# Altium schematic sheet 1-MCU.SchDoc
size A1
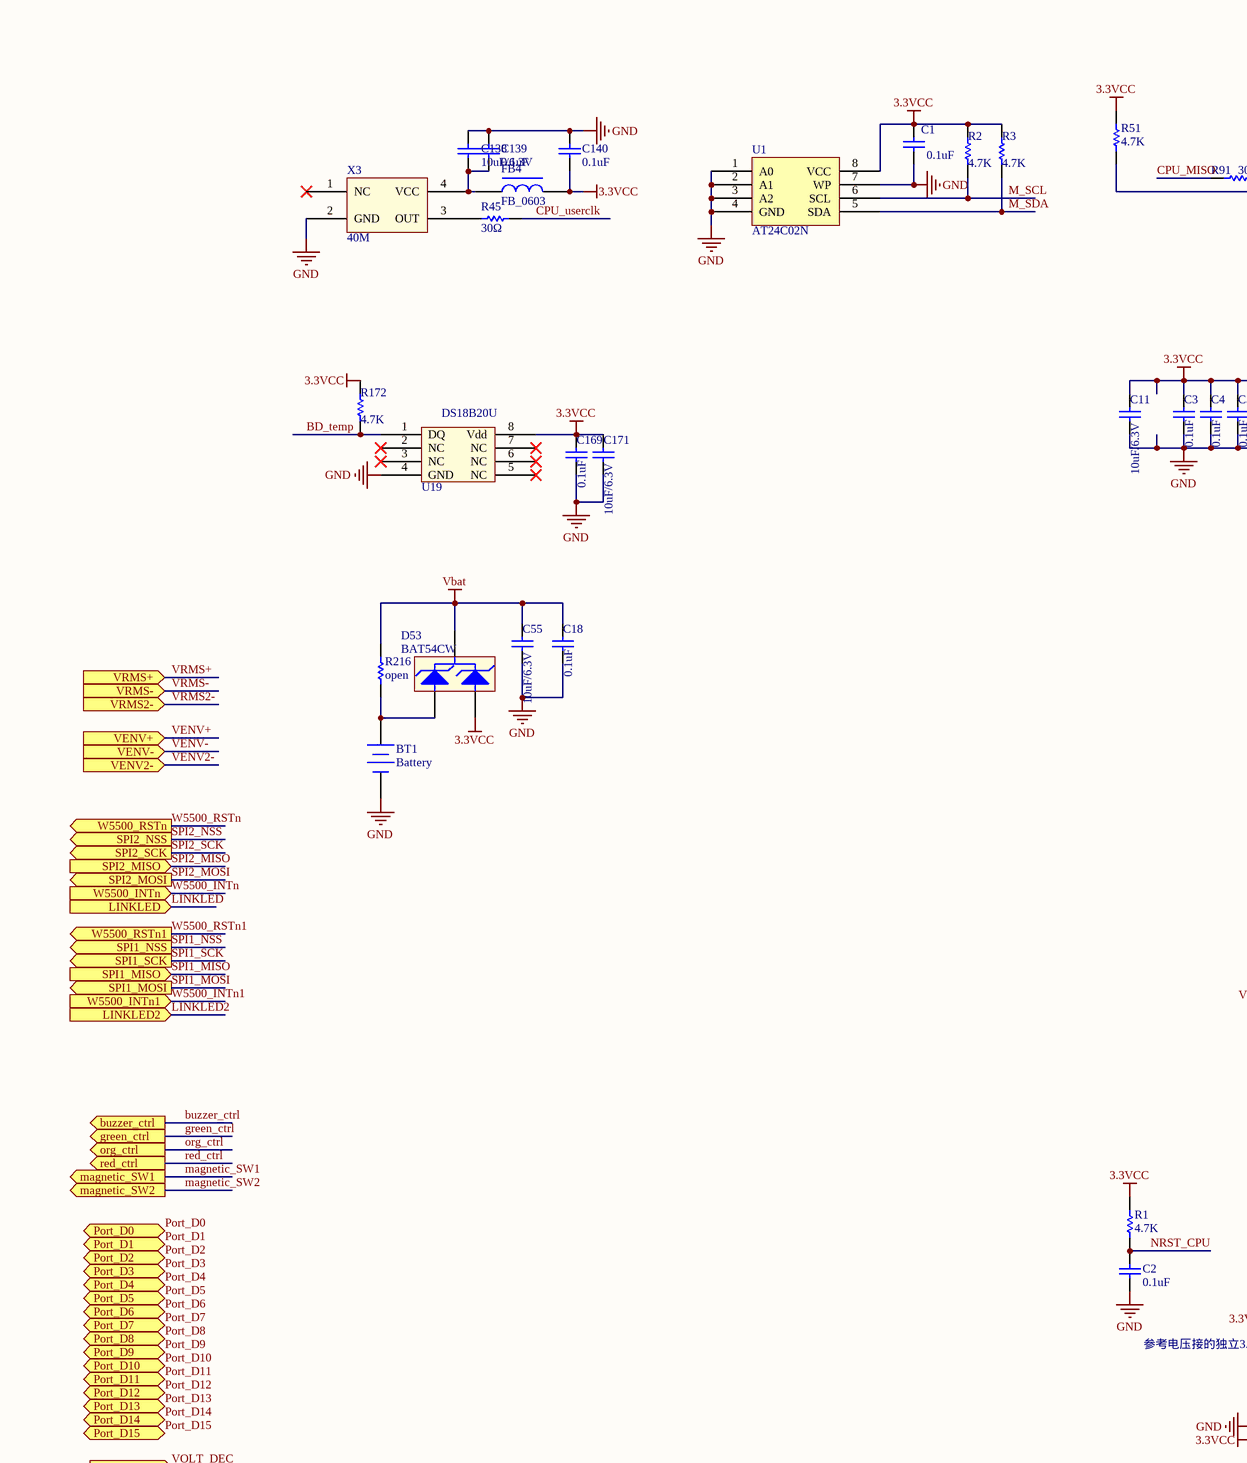
[diagram p0: 1-MCU.SchDoc, top left]
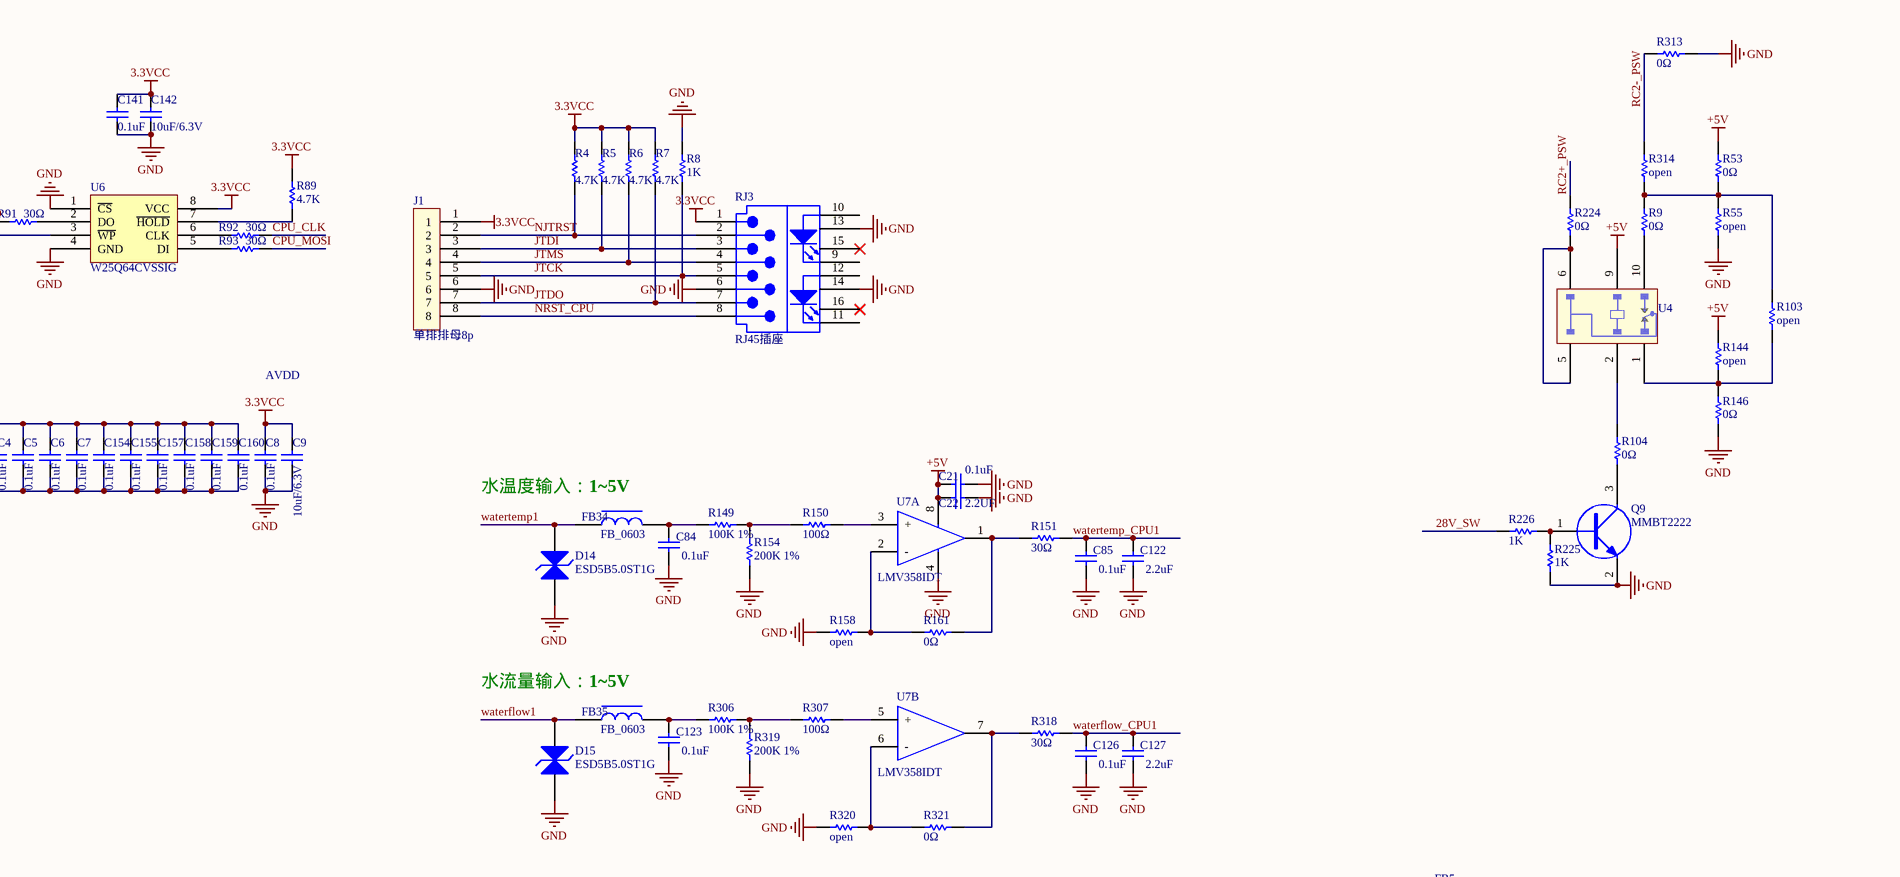
[diagram p1: 1-MCU.SchDoc, top middle]
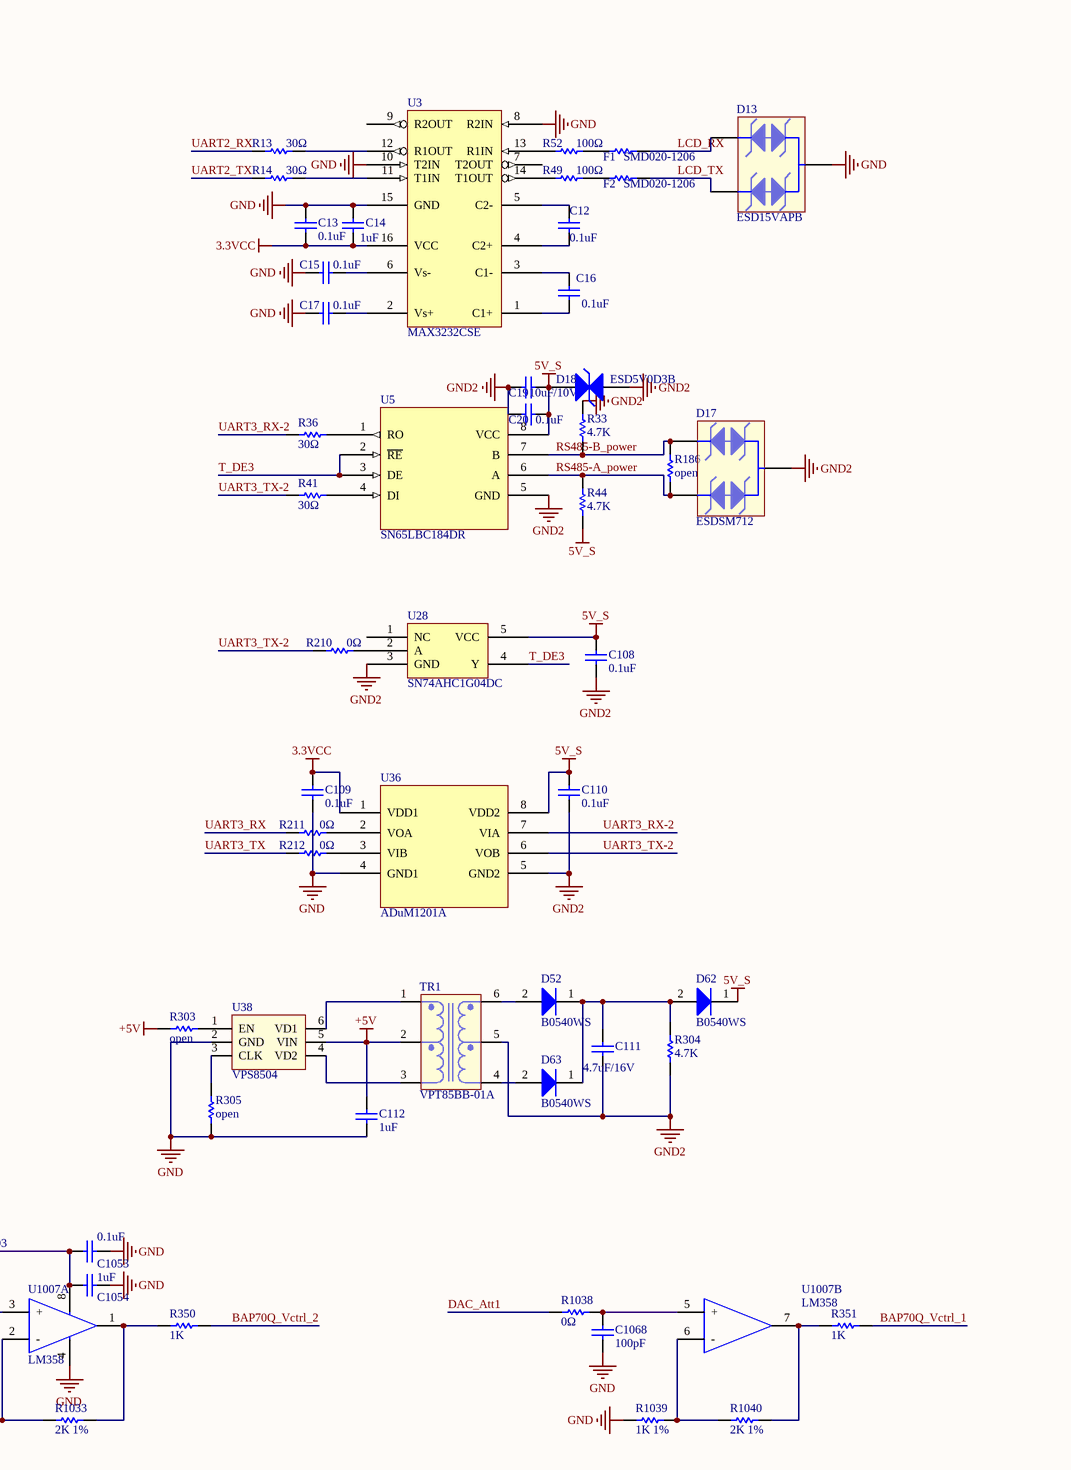
[diagram p2: 1-MCU.SchDoc, top right]
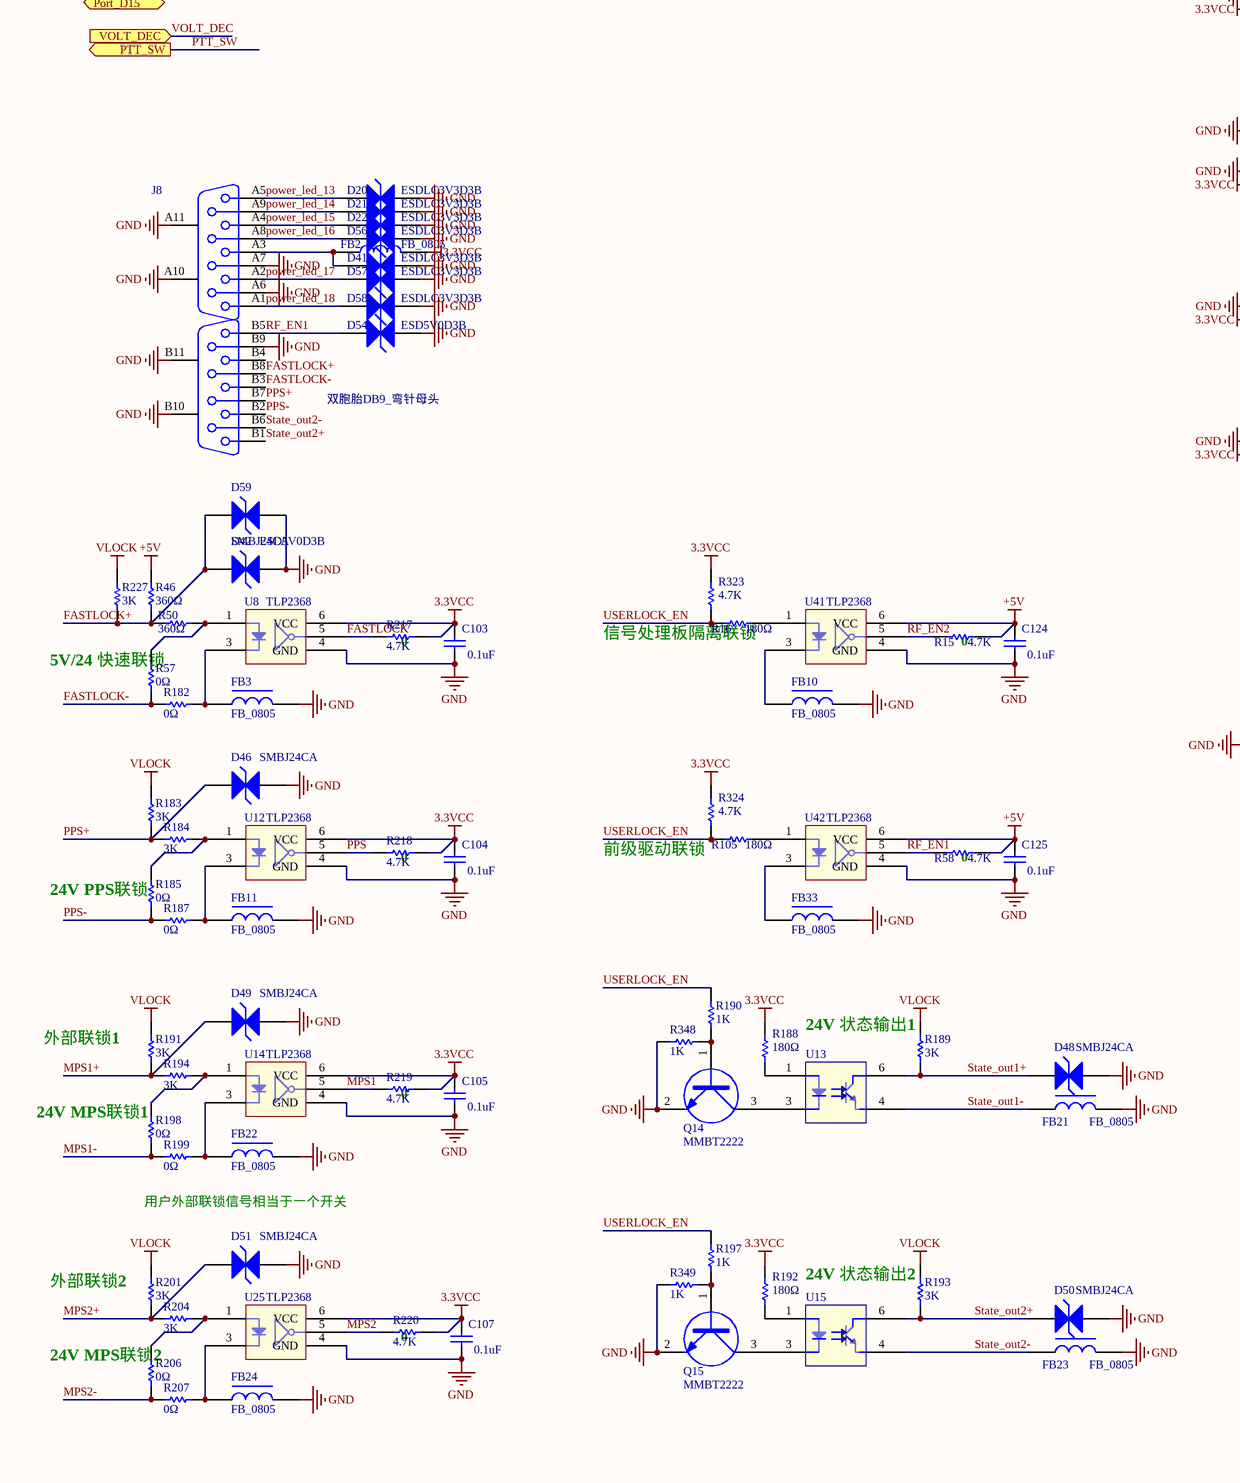
[diagram p3: 1-MCU.SchDoc, bottom left]
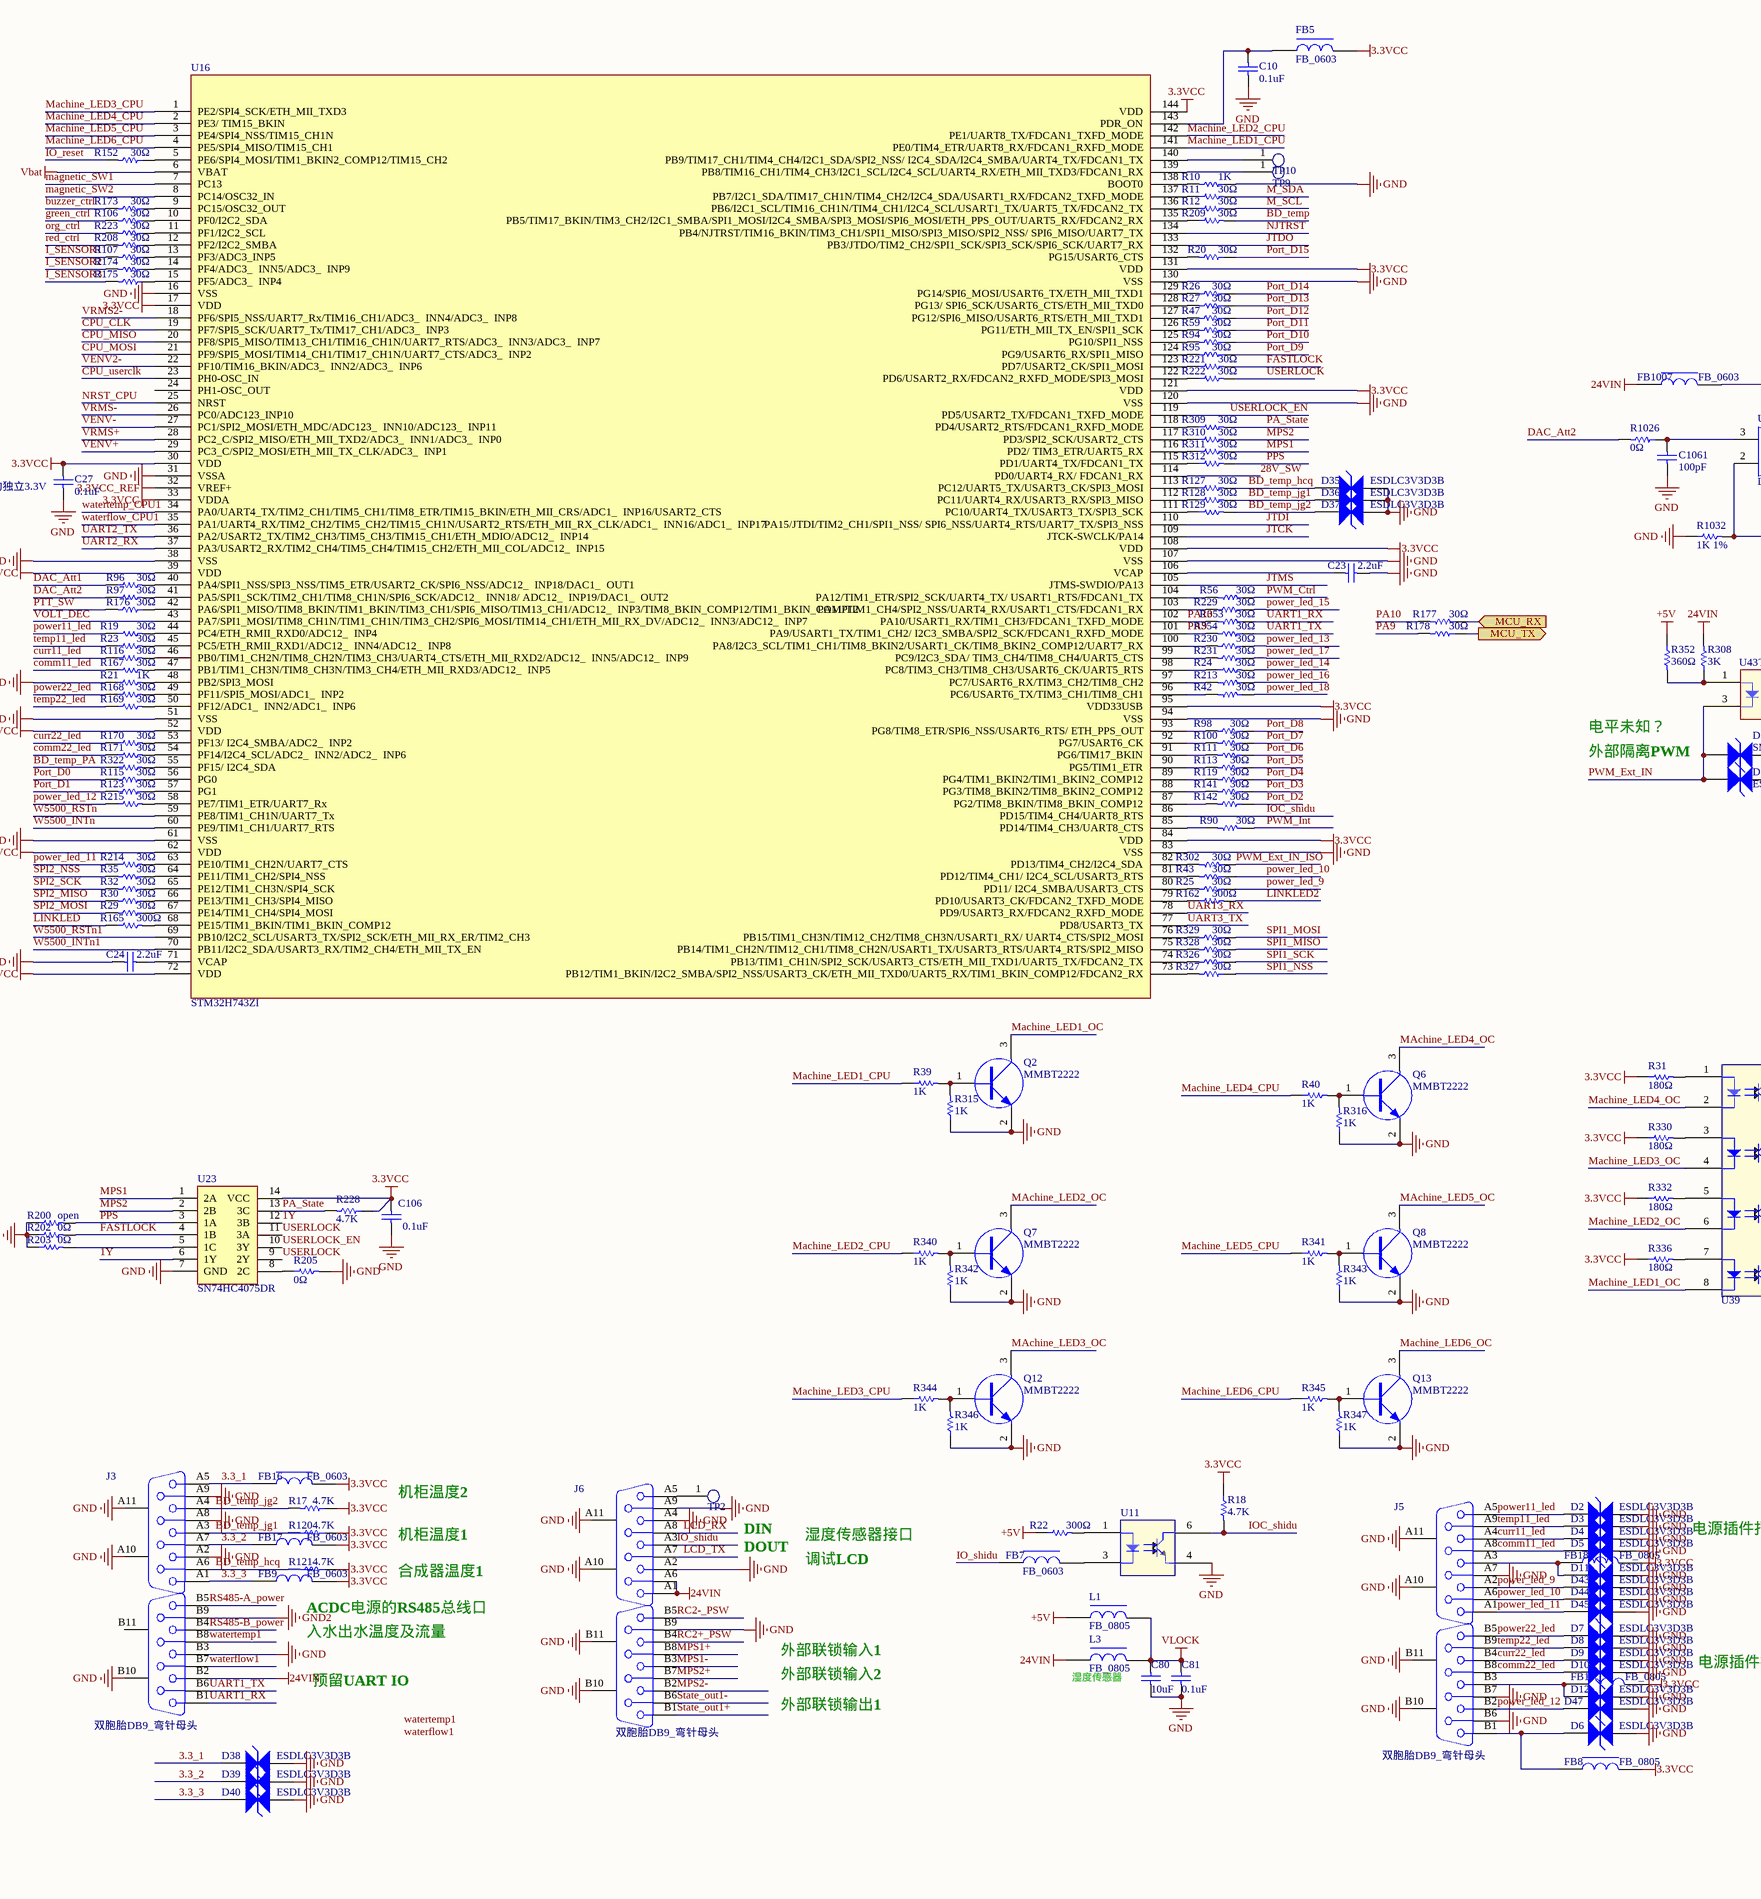
[diagram p4: 1-MCU.SchDoc, bottom middle]
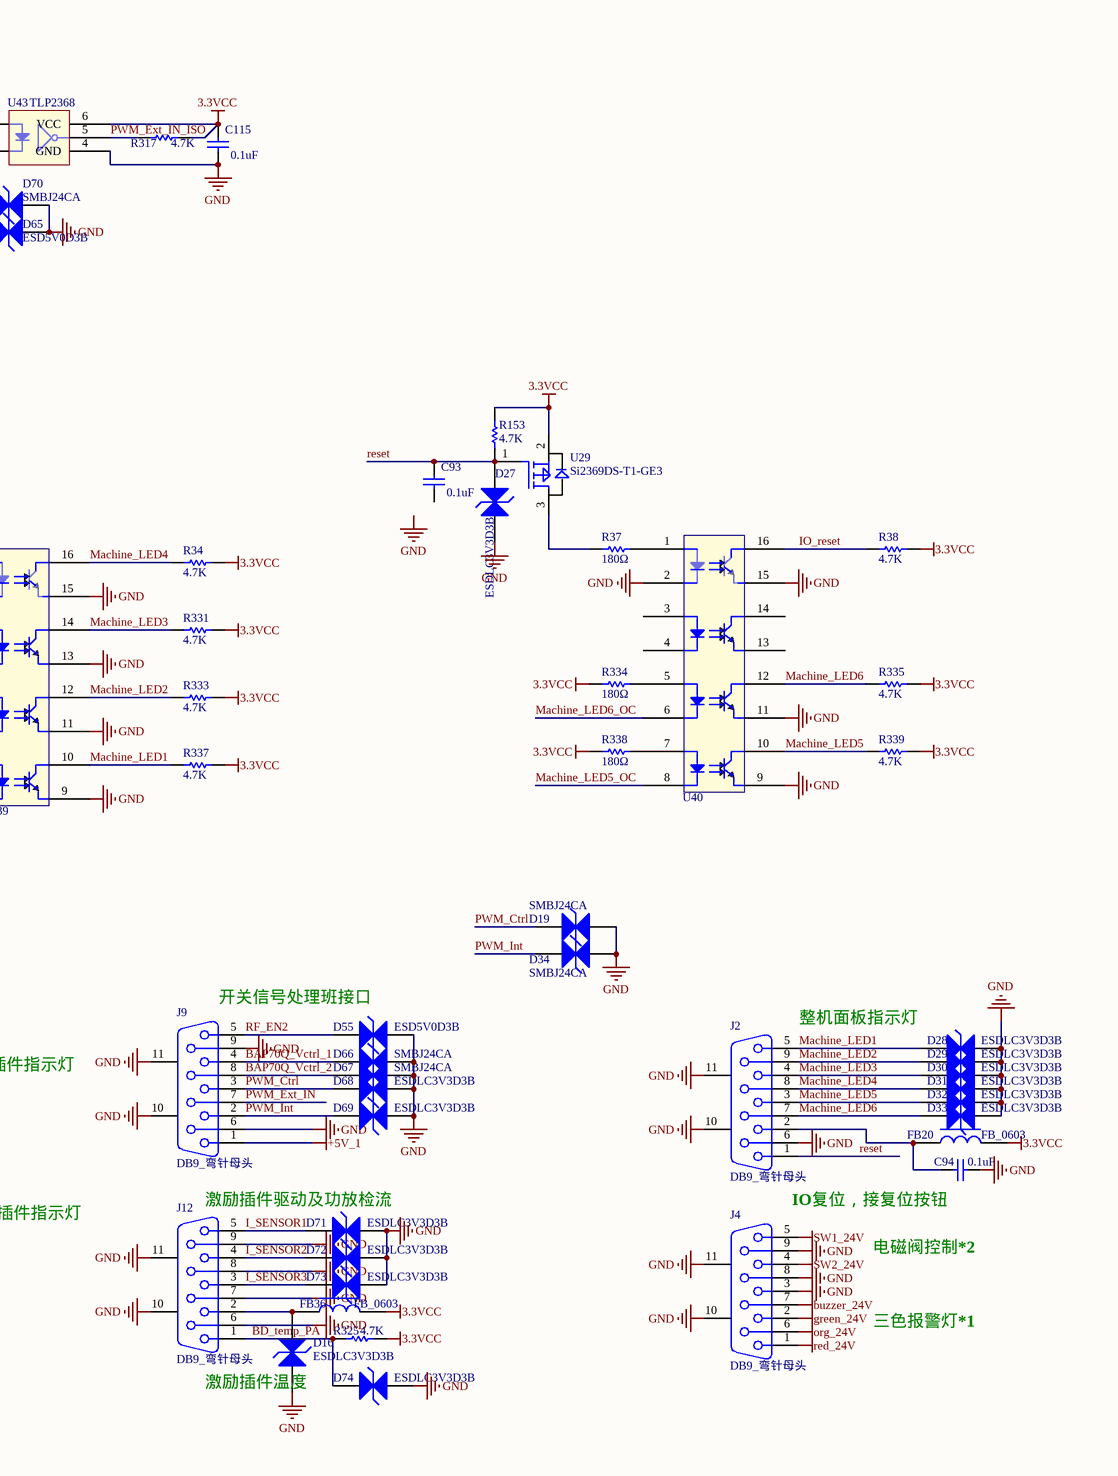
[diagram p5: 1-MCU.SchDoc, bottom right]

## Parts
BT1  Battery  [CR2032]
C1  0.1uF  [C0603]
C2  0.1uF  [C0603]
C3  0.1uF  [C0603]
C4  0.1uF  [C0603]
C5  0.1uF  [C0603]
C6  0.1uF  [C0603]
C7  0.1uF  [C0603]
C8  0.1uF  [C0603]
C9  10uF/6.3V  [C0603]
C10  0.1uF  [C0603]
C11  10uF/6.3V  [C0603]
C12  0.1uF  [C0603]
C13  0.1uF  [C0603]
C14  1uF  [C0603]
C15  0.1uF  [C0603]
C16  0.1uF  [C0603]
C17  0.1uF  [C0603]
C18  0.1uF  [C0603]
C19  10uF/10V  [C0805]
C20  0.1uF  [C0603]
C21  0.1uF  [C0603]
C22  2.2UF  [C0603]
C23  2.2uF  [C0603]
C24  2.2uF  [C0603]
C27  0.1uF  [C0603]
C55  10uF/6.3V  [C0603]
C80  10uF  [C1210]
C81  0.1uF  [C0603]
C84  0.1uF  [C0603]
C85  0.1uF  [C0603]
C93  0.1uF  [C0603]
C94  0.1uF  [C0603]
C103  0.1uF  [C0603]
C104  0.1uF  [C0603]
C105  0.1uF  [C0603]
C106  0.1uF  [C0603]
C107  0.1uF  [C0603]
C108  0.1uF  [C0603]
C109  0.1uF  [C0603]
C110  0.1uF  [C0603]
C111  4.7uF/16V  [C0603]
C112  1uF  [C0603]
C115  0.1uF  [C0603]
C122  2.2uF  [C0603]
C123  0.1uF  [C0603]
C124  0.1uF  [C0603]
C125  0.1uF  [C0603]
C126  0.1uF  [C0603]
C127  2.2uF  [C0603]
C138  10uF/6.3V  [C0603]
C139  0.1uF  [C0603]
C140  0.1uF  [C0603]
C141  0.1uF  [C0603]
C142  10uF/6.3V  [C0603]
C154  0.1uF  [C0603]
C155  0.1uF  [C0603]
C157  0.1uF  [C0603]
C158  0.1uF  [C0603]
C159  0.1uF  [C0603]
C160  0.1uF  [C0603]
C169  0.1uF  [C0603]
C171  10uF/6.3V  [C0603]
C1053  0.1uF  [C0603]
C1054  1uF  [C0603]
C1061  100pF  [C0603]
C1068  100pF  [C0603]
D2  ESDLC3V3D3B  [SOD-323]
D3  ESDLC3V3D3B  [SOD-323]
D4  ESDLC3V3D3B  [SOD-323]
D5  ESDLC3V3D3B  [SOD-323]
D6  ESDLC3V3D3B  [SOD-323]
D7  ESDLC3V3D3B  [SOD-323]
D8  ESDLC3V3D3B  [SOD-323]
D9  ESDLC3V3D3B  [SOD-323]
D10  ESDLC3V3D3B  [SOD-323]
D11  ESDLC3V3D3B  [SOD-323]
D12  ESDLC3V3D3B  [SOD-323]
D13  ESD15VAPB  [SOT23-3]
D14  ESD5B5.0ST1G  [SOD-523]
D15  ESD5B5.0ST1G  [SOD-523]
D16  ESDLC3V3D3B  [SOD-323]
D17  ESDSM712  [SOT23-3]
D18  ESD5V0D3B  [SOD-323]
D19  SMBJ24CA  [DO-214AA]  (no BOM)
D20  ESDLC3V3D3B  [SOD-323]
D21  ESDLC3V3D3B  [SOD-323]
D22  ESDLC3V3D3B  [SOD-323]
D27  ESDLC3V3D3B  [SOD-323]
D28  ESDLC3V3D3B  [SOD-323]
D29  ESDLC3V3D3B  [SOD-323]
D30  ESDLC3V3D3B  [SOD-323]
D31  ESDLC3V3D3B  [SOD-323]
D32  ESDLC3V3D3B  [SOD-323]
D33  ESDLC3V3D3B  [SOD-323]
D34  SMBJ24CA  [DO-214AA]  (no BOM)
D35  ESDLC3V3D3B  [SOD-323]
D36  ESDLC3V3D3B  [SOD-323]
D37  ESDLC3V3D3B  [SOD-323]
D38  ESDLC3V3D3B  [SOD-323]
D39  ESDLC3V3D3B  [SOD-323]
D40  ESDLC3V3D3B  [SOD-323]
D41  ESDLC3V3D3B  [SOD-323]
D42  ESD5V0D3B  [SOD-323]
D43  ESDLC3V3D3B  [SOD-323]
D44  ESDLC3V3D3B  [SOD-323]
D45  ESDLC3V3D3B  [SOD-323]
D46  SMBJ24CA  [DO-214AA]
D47  ESDLC3V3D3B  [SOD-323]
D48  SMBJ24CA  [DO-214AA]
D49  SMBJ24CA  [DO-214AA]
D50  SMBJ24CA  [DO-214AA]
D51  SMBJ24CA  [DO-214AA]
D52  B0540WS  [SOD-323]
D53  BAT54CW  [SOT-323]
D54  ESD5V0D3B  [SOD-323]
D55  ESD5V0D3B  [SOD-323]
D56  ESDLC3V3D3B  [SOD-323]
D57  ESDLC3V3D3B  [SOD-323]
D58  ESDLC3V3D3B  [SOD-323]
D59  SMBJ24CA  [DO-214AA]  (no BOM)
D62  B0540WS  [SOD-323]
D63  B0540WS  [SOD-323]
D65  ESD5V0D3B  [SOD-323]
D66  SMBJ24CA  [DO-214AA]
D67  SMBJ24CA  [DO-214AA]
D68  ESDLC3V3D3B  [SOD-323]
D69  ESDLC3V3D3B  [SOD-323]
D70  SMBJ24CA  [DO-214AA]  (no BOM)
D71  ESDLC3V3D3B  [SOD-323]
D72  ESDLC3V3D3B  [SOD-323]
D73  ESDLC3V3D3B  [SOD-323]
D74  ESDLC3V3D3B  [SOD-323]
F1  SMD020-1206  [R1206]
F2  SMD020-1206  [R1206]
FB2  FB_0805  [L0805]
FB3  FB_0805  [L0805]
FB4  FB_0603  [L0603]
FB5  FB_0603  [L0603]
FB7  FB_0603  [L0603]
FB8  FB_0805  [L0805]
FB9  FB_0603  [L0603]
FB10  FB_0805  [L0805]
FB11  FB_0805  [L0805]
FB16  FB_0603  [L0603]
FB17  FB_0603  [L0603]
FB18  FB_0805  [L0805]
FB19  FB_0805  [L0805]
FB20  FB_0603  [L0603]
FB21  FB_0805  [L0805]
FB22  FB_0805  [L0805]
FB23  FB_0805  [L0805]
FB24  FB_0805  [L0805]
FB33  FB_0805  [L0805]
FB34  FB_0603  [L0603]
FB35  FB_0603  [L0603]
FB36  FB_0603  [L0603]
FB1007  FB_0603  [L0603]
J1  单排排母8p  [SIP8TM-2R54]
J2  DB9_弯针母头  [DB9TM-RF]
J3  双胞胎DB9_弯针母头  [DB9TM-RF-双胞胎]
J4  DB9_弯针母头  [DB9TM-RF]
J5  双胞胎DB9_弯针母头  [DB9TM-RF-双胞胎]
J6  双胞胎DB9_弯针母头  [DB9TM-RF-双胞胎]
J8  双胞胎DB9_弯针母头  [DB9TM-RF-双胞胎]
J9  DB9_弯针母头  [DB9TM-RF]
J12  DB9_弯针母头  [DB9TM-RF]
L1  FB_0805  [L0805]
L3  FB_0805  [L0805]  (no BOM)
Q2  MMBT2222  [SOT23-3]
Q6  MMBT2222  [SOT23-3]
Q7  MMBT2222  [SOT23-3]
Q8  MMBT2222  [SOT23-3]
Q9  MMBT2222  [SOT23-3]
Q12  MMBT2222  [SOT23-3]
Q13  MMBT2222  [SOT23-3]
Q14  MMBT2222  [SOT23-3]
Q15  MMBT2222  [SOT23-3]
R1  4.7K  [R0603]
R2  4.7K  [R0603]
R3  4.7K  [R0603]
R4  4.7K  [R0603]
R5  4.7K  [R0603]
R6  4.7K  [R0603]
R7  4.7K  [R0603]
R8  1K  [R0603]
R9  0Ω  [R0603]
R10  1K  [R0603]
R11  30Ω  [R0603]
R12  30Ω  [R0603]
R13  30Ω  [R0603]
R14  30Ω  [R0603]
R15  4.7K  [R0603]
R16  180Ω  [R0603]
R17  4.7K  [R0603]
R18  4.7K  [R0603]
R19  30Ω  [R0603]
R20  30Ω  [R0603]
R21  1K  [R0603]
R22  300Ω  [R0603]
R23  30Ω  [R0603]
R24  30Ω  [R0603]
R25  30Ω  [R0603]
R26  30Ω  [R0603]
R27  30Ω  [R0603]
R29  30Ω  [R0603]
R30  30Ω  [R0603]
R31  180Ω  [R0603]
R32  30Ω  [R0603]
R33  4.7K  [R0603]
R34  4.7K  [R0603]
R35  30Ω  [R0603]
R36  30Ω  [R0603]
R37  180Ω  [R0603]
R38  4.7K  [R0603]
R39  1K  [R0603]
R40  1K  [R0603]
R41  30Ω  [R0603]
R42  30Ω  [R0603]
R43  30Ω  [R0603]
R44  4.7K  [R0603]
R45  30Ω  [R0603]
R46  360Ω  [R0603]
R47  30Ω  [R0603]
R49  100Ω  [R0603]
R50  360Ω  [R1206]  (no BOM)
R51  4.7K  [R0603]
R52  100Ω  [R0603]
R53  0Ω  [R0603]
R55  open  [R0603]  (no BOM)
R56  30Ω  [R0603]
R57  0Ω  [R0603]
R58  4.7K  [R0603]
R59  30Ω  [R0603]
R89  4.7K  [R0603]
R90  30Ω  [R0603]
R91  30Ω  [R0603]
R92  30Ω  [R0603]
R93  30Ω  [R0603]
R94  30Ω  [R0603]
R95  30Ω  [R0603]
R96  30Ω  [R0603]
R97  30Ω  [R0603]
R98  30Ω  [R0603]
R100  30Ω  [R0603]
R103  open  [R0603]  (no BOM)
R104  0Ω  [R0603]
R105  180Ω  [R0603]
R106  30Ω  [R0603]
R107  30Ω  [R0603]
R111  30Ω  [R0603]
R113  30Ω  [R0603]
R115  30Ω  [R0603]
R116  30Ω  [R0603]
R119  30Ω  [R0603]
R120  4.7K  [R0603]
R121  4.7K  [R0603]
R123  30Ω  [R0603]
R127  30Ω  [R0603]
R128  30Ω  [R0603]
R129  30Ω  [R0603]
R141  30Ω  [R0603]
R142  30Ω  [R0603]
R144  open  [R0603]  (no BOM)
R146  0Ω  [R0603]
R149  100K 1%  [R0603]
R150  100Ω  [R0603]
R151  30Ω  [R0603]
R152  30Ω  [R0603]
R153  4.7K  [R0603]
R154  200K 1%  [R0603]
R158  open  [R0603]  (no BOM)
R161  0Ω  [R0603]
R162  300Ω  [R0603]
R165  300Ω  [R0603]
R167  30Ω  [R0603]
R168  30Ω  [R0603]
R169  30Ω  [R0603]
R170  30Ω  [R0603]
R171  30Ω  [R0603]
R172  4.7K  [R0603]
R173  30Ω  [R0603]
R174  30Ω  [R0603]
R175  30Ω  [R0603]
R176  30Ω  [R0603]
R177  30Ω  [R0603]
R178  30Ω  [R0603]
R182  0Ω  [R0603]  (no BOM)
R183  3K  [R1206]
R184  3K  [R1206]  (no BOM)
R185  0Ω  [R0603]
R186  open  [R0603]  (no BOM)
R187  0Ω  [R0603]  (no BOM)
R188  180Ω  [R0603]
R189  3K  [R1206]
R190  1K  [R0603]
R191  3K  [R1206]
R192  180Ω  [R0603]
R193  3K  [R1206]
R194  3K  [R1206]  (no BOM)
R197  1K  [R0603]
R198  0Ω  [R0603]
R199  0Ω  [R0603]  (no BOM)
R200  open  [R0603]  (no BOM)
R201  3K  [R1206]
R202  0Ω  [R0603]
R203  0Ω  [R0603]
R204  3K  [R1206]  (no BOM)
R205  0Ω  [R0603]
R206  0Ω  [R0603]
R207  0Ω  [R0603]  (no BOM)
R208  30Ω  [R0603]
R209  30Ω  [R0603]
R210  0Ω  [R0603]
R211  0Ω  [R0603]
R212  0Ω  [R0603]
R213  30Ω  [R0603]
R214  30Ω  [R0603]
R215  30Ω  [R0603]
R216  open  [R0603]  (no BOM)
R217  4.7K  [R0603]
R218  4.7K  [R0603]
R219  4.7K  [R0603]
R220  4.7K  [R0603]
R221  30Ω  [R0603]
R222  30Ω  [R0603]
R223  30Ω  [R0603]
R224  0Ω  [R0603]
R225  1K  [R0603]
R226  1K  [R0603]
R227  3K  [R1206]  (no BOM)
R228  4.7K  [R0603]
R229  30Ω  [R0603]
R230  30Ω  [R0603]
R231  30Ω  [R0603]
R302  30Ω  [R0603]
R303  open  [R0603]  (no BOM)
R304  4.7K  [R0603]
R305  open  [R0603]  (no BOM)
R306  100K 1%  [R0603]
R307  100Ω  [R0603]
R308  3K  [R1206]  (no BOM)
R309  30Ω  [R0603]
R310  30Ω  [R0603]
R311  30Ω  [R0603]
R312  30Ω  [R0603]
R313  0Ω  [R0603]
R314  open  [R0603]  (no BOM)
R315  1K  [R0603]
R316  1K  [R0603]
R317  4.7K  [R0603]
R318  30Ω  [R0603]
R319  200K 1%  [R0603]
R320  open  [R0603]  (no BOM)
R321  0Ω  [R0603]
R322  30Ω  [R0603]
R323  4.7K  [R0603]
R324  4.7K  [R0603]
R325  4.7K  [R0603]
R326  30Ω  [R0603]
R327  30Ω  [R0603]
R328  30Ω  [R0603]
R329  30Ω  [R0603]
R330  180Ω  [R0603]
R331  4.7K  [R0603]
R332  180Ω  [R0603]
R333  4.7K  [R0603]
R334  180Ω  [R0603]
R335  4.7K  [R0603]
R336  180Ω  [R0603]
R337  4.7K  [R0603]
R338  180Ω  [R0603]
R339  4.7K  [R0603]
R340  1K  [R0603]
R341  1K  [R0603]
R342  1K  [R0603]
R343  1K  [R0603]
R344  1K  [R0603]
R345  1K  [R0603]
R346  1K  [R0603]
R347  1K  [R0603]
R348  1K  [R0603]
R349  1K  [R0603]
R350  1K  [R0603]
R351  1K  [R0603]
R352  360Ω  [R0603]
R353  30Ω  [R0603]  (no BOM)
R354  30Ω  [R0603]  (no BOM)
R1026  0Ω  [R0603]
R1032  1K 1%  [R0603]
R1033  2K 1%  [R0603]
R1038  0Ω  [R0603]
R1039  1K 1%  [R0603]
R1040  2K 1%  [R0603]
RJ3  RJ45插座  [RJ45TH-1x1-2R54-LED]
TP2  TEST  [TP0R8]  (value not drawn)  (no BOM)
TP9  TEST  [TP0R8]  (value not drawn)  (no BOM)
TP10  TEST  [TP0R8]  (value not drawn)  (no BOM)
TR1  VPT85BB-01A  [VPT85BB-01A-6SM-2R54-6R65X7R45]
U1  AT24C02N  [SOIC8_1R27_3R9x4R9]
U3  MAX3232CSE  [SOIC16-1R27-3R9x9R9]
U4  G5V-1-5VDC  [G5V-1-5VDC]  (value not drawn)
U5  SN65LBC184DR  [SOIC8_1R27_3R9x4R9]
U6  W25Q64CVSSIG  [SOIC8_1R27_5R3x5R3]
U7  LMV358IDT  [SOIC8_1R27_3R9x4R9]  (parts A,B of 2)
U8  TLP2368  [SO6-1R27-4R55X3R7]
U11  TLP181  [TLP181]  (value not drawn)
U12  TLP2368  [SO6-1R27-4R55X3R7]
U13  TLP181  [TLP181]  (value not drawn)
U14  TLP2368  [SO6-1R27-4R55X3R7]
U15  TLP181  [TLP181]  (value not drawn)
U16  STM32H743ZI  [LQFP144_0R5_20x20]
U19  DS18B20U  [TSSOP8-0R65-3R0x3R0]
U23  SN74HC4075DR  [SOIC14-1R27-3R9x8R65]
U25  TLP2368  [SO6-1R27-4R55X3R7]
U28  SN74AHC1G04DC  [SC70-5-1R3x2R2]
U29  Si2369DS-T1-GE3  [SOT23-3]
U36  ADuM1201A  [SOIC8_1R27_3R9x4R9]
U38  VPS8504  [SOT23-6]
U39  LTV-247  [SOIC16-1R27-3R9x9R9]  (value not drawn)
U40  LTV-247  [SOIC16-1R27-3R9x9R9]  (value not drawn)
U41  TLP2368  [SO6-1R27-4R55X3R7]
U42  TLP2368  [SO6-1R27-4R55X3R7]
U43  TLP2368  [SO6-1R27-4R55X3R7]
U1007  LM358  [SOIC8_1R27_3R9x4R9]  (parts A,B of 2)
X3  40M  [CRY4SM-5R0x7R0]

## Ports
buzzer_ctrl (out), green_ctrl (out), LINKLED2 (in), LINKLED (in), magnetic_SW1 (out), magnetic_SW2 (out), MCU_RX (in), MCU_TX (out), org_ctrl (out), Port_D0 (bidir), Port_D1 (bidir), Port_D2 (bidir), Port_D3 (bidir), Port_D4 (bidir), Port_D5 (bidir), Port_D6 (bidir), Port_D7 (bidir), Port_D8 (bidir), Port_D9 (bidir), Port_D10 (bidir), Port_D11 (bidir), Port_D12 (bidir), Port_D13 (bidir), Port_D14 (bidir), Port_D15 (bidir), PTT_SW (out), red_ctrl (out), SPI1_MISO (in), SPI1_MOSI (out), SPI1_NSS (out), SPI1_SCK (out), SPI2_MISO (in), SPI2_MOSI (out), SPI2_NSS (out), SPI2_SCK (out), VENV2- (in), VENV+ (in), VENV- (in), VOLT_DEC (in), VRMS2- (in), VRMS+ (in), VRMS- (in), W5500_INTn1 (in), W5500_INTn (in), W5500_RSTn1 (out), W5500_RSTn (out)

## Nets
3.3VCC: C1.2 C3.2 C4.2 C5.2 C6.2 C7.2 C8.2 C9.2 C11.2 C13.2 C14.1 C27.2 C103.2 C104.2 C105.2 C106.2 C107.2 C109.2 C115.2 C140.1 C141.2 C142.2 C154.2 C155.2 C157.2 C158.2 C159.2 C160.2 C169.2 C171.2 D53.2 FB2.2 FB4.2 FB5.2 FB8.2 FB9.2 FB16.2 FB17.2 FB18.2 FB19.2 FB20.2 FB36.2 J1.1 R1.2 R2.2 R3.2 R4.2 R5.2 R6.2 R7.2 R17.1 R18.1 R31.1 R34.1 R38.1 R51.1 R89.1 R120.1 R121.1 R153.2 R172.2 R188.1 R192.1 R217.1 R218.1 R219.1 R220.1 R228.1 R317.1 R323.1 R324.1 R325.1 R330.1 R331.1 R332.1 R333.1 R334.1 R335.1 R336.1 R337.1 R338.1 R339.1 RJ3.1(TX+) U1.8(VCC) U3.16(VCC) U6.8(VCC) U8.6(VCC) U12.6(VCC) U14.6(VCC) U16.17(VDD) U16.30(VDD) U16.33(VDDA) U16.39(VDD) U16.52(VDD) U16.62(VDD) U16.72(VDD) U16.84(VDD) U16.95(VDD33USB) U16.108(VDD) U16.121(VDD) U16.131(VDD) U16.144(VDD) U19.8(Vdd) U23.14(VCC) U25.6(VCC) U29.2(S) U36.1(VDD1) U43.6(VCC)
3.3VCC_REF: U16.32(VREF+)
5V_S: C19.2 C20.2 C108.2 C110.2 D18.1 D62.1(K) R44.1 U5.8(VCC) U28.5(VCC) U36.8(VDD2)
24VIN: FB1007.1 J3.B2 J6.A1 J6.A6 L3.1 R308.2
+5V: C21.2 C22.1 C112.2 C124.2 C125.2 L1.1 R15.1 R22.1 R46.2 R53.2 R58.1 R144.2 R303.1 R352.1 TR1.2 U4.9 U7.8 U38.5(VIN) U41.6(VCC) U42.6(VCC)
+5V_1: J9.1
buzzer_24V: J4.7
GND: BT1.2(-) C1.1 C2.1 C3.1 C4.1 C5.1 C6.1 C7.1 C8.1 C9.1 C10.2 C11.1 C13.1 C14.2 C15.2 C17.2 C18.1 C21.1 C22.2 C23.1 C24.2 C27.1 C55.1 C80.1 C81.1 C84.1 C85.1 C94.2 C103.1 C104.1 C105.1 C106.1 C107.1 C109.1 C112.1 C115.1 C122.1 C123.1 C124.1 C125.1 C126.1 C127.1 C138.1 C139.2 C140.2 C141.1 C142.1 C154.1 C155.1 C157.1 C158.1 C159.1 C160.1 C169.1 C171.1 C1053.1 C1054.2 C1061.1 C1068.1 D2.2 D3.2 D4.2 D5.2 D6.2 D7.2 D8.2 D9.2 D10.2 D11.2 D12.2 D13.3 D14.1 D15.1 D16.2 D19.1 D20.2 D21.2 D22.2 D27.2 D28.2 D29.2 D30.2 D31.2 D32.2 D33.2 D34.1 D35.2 D36.2 D37.2 D38.2 D39.2 D40.2 D41.2 D42.2 D43.2 D44.2 D45.2 D46.1 D47.2 D48.1 D49.1 D50.1 D51.1 D54.2 D55.2 D56.2 D57.2 D58.2 D59.1 D65.2 D66.1 D67.1 D68.2 D69.2 D70.1 D71.2 D72.2 D73.2 D74.2 FB3.2 FB10.2 FB11.2 FB21.2 FB22.2 FB23.2 FB24.2 FB33.2 J1.6 J2.6 J2.10 J2.11 J3.A2 J3.A8 J3.A9 J3.A10 J3.A11 J3.B3 J3.B10 J4.3 J4.8 J4.9 J4.10 J4.11 J5.A7 J5.A10 J5.A11 J5.B6 J5.B7 J5.B10 J5.B11 J6.A2 J6.A4 J6.A9 J6.A10 J6.A11 J6.B9 J6.B10 J6.B11 J8.A6 J8.A7 J8.A10 J8.A11 J8.B9 J8.B10 J8.B11 J9.6 J9.9 J9.10 J9.11 J12.6 J12.7 J12.8 J12.9 J12.10 J12.11 Q2.2(E) Q6.2(E) Q7.2(E) Q8.2(E) Q9.2(E) Q12.2(E) Q13.2(E) Q14.2(E) Q15.2(E) R8.1 R10.1 R21.1 R55.1 R146.1 R154.1 R158.1 R200.1 R202.1 R203.1 R205.2 R225.1 R305.1 R313.2 R315.1 R316.1 R319.1 R320.1 R342.1 R343.1 R346.1 R347.1 R348.1 R349.1 R1032.1 R1039.1 RJ3.6(RX-) RJ3.13 RJ3.14 U1.1(A0) U1.2(A1) U1.3(A2) U1.4(GND) U1.7(WP) U3.8(R2IN) U3.10(T2IN) U3.15(GND) U6.1(~{CS}) U6.4(GND) U7.4 U8.4(GND) U11.4 U12.4(GND) U14.4(GND) U16.16(VSS) U16.31(VSSA) U16.38(VSS) U16.51(VSS) U16.61(VSS) U16.83(VSS) U16.94(VSS) U16.107(VSS) U16.120(VSS) U16.130(VSS) U19.4(GND) U23.7(GND) U25.4(GND) U36.4(GND1) U38.2(GND) U39.9 U39.11 U39.13 U39.15 U40.2 U40.9 U40.11 U40.15 U41.4(GND) U42.4(GND) U43.4(GND) U1007.4 X3.2(GND)
GND2: C19.1 C20.1 C108.1 C110.1 C111.1 D17.3 D18.2 J3.B9 R33.2 R304.1 TR1.5 U5.5(GND) U28.3(GND) U36.5(GND2)
green_24V: J4.2
org_24V: J4.6
red_24V: J4.1
SW1_24V: J4.5
SW2_24V: J4.4
Vbat: C18.2 C55.2 D53.3 R216.2 U16.6(VBAT)
VLOCK: C80.2 C81.2 L1.2 L3.2 R183.2 R189.2 R191.2 R193.2 R201.2 R227.2
1Y: U23.6(1Y) U23.12(3B)
3.3_1: D38.1 FB16.1 J3.A5
3.3_2: D39.1 FB17.1 J3.A7
3.3_3: D40.1 FB9.1 J3.A1
28V_SW: R226.1 U16.114(PD0/UART4_RX/_FDCAN1_RX)
BAP70Q_Vctrl_1: D66.2 J9.4 R351.2
BAP70Q_Vctrl_2: D67.2 J9.8 R350.2
BD_temp: R172.1 R209.2 U19.1(DQ)
BD_temp_hcq: D35.1 J3.A6 R121.2 R127.2
BD_temp_jg1: D36.1 J3.A3 R120.2 R128.2
BD_temp_jg2: D37.1 J3.A4 R17.2 R129.2
BD_temp_PA: D74.1 J12.1 R322.1 R325.2
buzzer_ctrl: R173.2 ; port buzzer_ctrl
comm11_led: D5.1 J5.A8 R167.1
comm22_led: D10.1 J5.B8 R171.1
CPU_CLK: R92.2 U16.19(PF7/SPI5_SCK/UART7_Tx/TIM17_CH1/ADC3___INP3)
CPU_MISO: R91.1 U16.20(PF8/SPI5_MISO/TIM13_CH1/TIM16_CH1N/UART7_RTS/ADC3___INN3/ADC3___INP7)
CPU_MOSI: R93.2 U16.21(PF9/SPI5_MOSI/TIM14_CH1/TIM17_CH1N/UART7_CTS/ADC3___INP2)
CPU_userclk: R45.2 U16.23(PH0-OSC_IN)
curr11_led: D4.1 J5.A4 R116.1
curr22_led: D9.1 J5.B4 R170.1
DAC_Att1: R96.1 R1038.2
DAC_Att2: R97.1 R1026.2
FASTLOCK: R202.2 R217.2 R221.2 U8.5(Vo) U23.4(1B)
FASTLOCK+: D42.1 D59.2 J8.B8 R46.1 R50.2 R227.1
FASTLOCK-: J8.B3 R57.2 R182.2
green_ctrl: R106.2 ; port green_ctrl
I_SENSOR1: D71.1 J12.5 R107.2
I_SENSOR2: D72.1 J12.4 R174.2
I_SENSOR3: D73.1 J12.3 R175.2
IO_reset: R38.2 R152.2 U40.16
IO_shidu: FB7.1 J6.A3
IOC_shidu: R18.2 U11.6 U16.86(PD15/TIM4_CH4/UART8_RTS)
JTCK: J1.5 R8.2 RJ3.5(NC) U16.109(JTCK-SWCLK/PA14)
JTDI: J1.3 R5.1 RJ3.3(RX+) U16.110(PA15/JTDI/TIM2_CH1/SPI1_NSS/_SPI6_NSS/UART4_RTS/UART7_TX/SPI3_NSS)
JTDO: J1.7 R7.1 RJ3.7(NC) U16.133(PB3/JTDO/TIM2_CH2/SPI1_SCK/SPI3_SCK/SPI6_SCK/UART7_RX)
JTMS: J1.4 R6.1 RJ3.4(NC) U16.105(JTMS-SWDIO/PA13)
LCD_RX: D13.2 F1.2 J6.A8
LCD_TX: D13.1 F2.2 J6.A7
LINKLED: R165.1 ; port LINKLED
LINKLED2: R162.2 ; port LINKLED2
M_SCL: R2.1 R12.2 U1.6(SCL)
M_SDA: R3.1 R11.2 U1.5(SDA)
Machine_LED1: D28.1 J2.5 R337.2 U39.10
Machine_LED1_CPU: R39.1 U16.141(PE0/TIM4_ETR/UART8_RX/FDCAN1_RXFD_MODE)
Machine_LED1_OC: Q2.3(C) U39.8
Machine_LED2: D29.1 J2.9 R333.2 U39.12
Machine_LED2_CPU: R340.1 U16.142(PE1/UART8_TX/FDCAN1_TXFD_MODE)
Machine_LED2_OC: Q7.3(C) U39.6
Machine_LED3: D30.1 J2.4 R331.2 U39.14
Machine_LED3_CPU: R344.1 U16.1(PE2/SPI4_SCK/ETH_MII_TXD3)
Machine_LED3_OC: Q12.3(C) U39.4
Machine_LED4: D31.1 J2.8 R34.2 U39.16
Machine_LED4_CPU: R40.1 U16.2(PE3/_TIM15_BKIN)
Machine_LED4_OC: Q6.3(C) U39.2
Machine_LED5: D32.1 J2.3 R339.2 U40.10
Machine_LED5_CPU: R341.1 U16.3(PE4/SPI4_NSS/TIM15_CH1N)
Machine_LED5_OC: Q8.3(C) U40.8
Machine_LED6: D33.1 J2.7 R335.2 U40.12
Machine_LED6_CPU: R345.1 U16.4(PE5/SPI4_MISO/TIM15_CH1)
Machine_LED6_OC: Q13.3(C) U40.6
magnetic_SW1: U16.7(PC13) ; port magnetic_SW1
magnetic_SW2: U16.8(PC14/OSC32_IN) ; port magnetic_SW2
MCU_RX: R177.1 ; port MCU_RX
MCU_TX: R178.1 ; port MCU_TX
MPS1: R219.2 R311.2 U14.5(Vo) U23.1(2A)
MPS1+: D49.2 J6.B8 R191.1 R194.2
MPS1-: J6.B3 R198.2 R199.2
MPS2: R220.2 R310.2 U23.2(2B) U25.5(Vo)
MPS2+: D51.2 J6.B7 R201.1 R204.2
MPS2-: J6.B2 R206.2 R207.2
NJTRST: J1.2 R4.1 RJ3.2(TX-) U16.134(PB4/NJTRST/TIM16_BKIN/TIM3_CH1/SPI1_MISO/SPI3_MISO/SPI2_NSS/_SPI6_MISO/UART7_TX)
NRST_CPU: C2.2 J1.8 R1.1 RJ3.8(NC) U16.25(NRST)
org_ctrl: R223.2 ; port org_ctrl
PA9: R178.2 R354.2 U16.101(PA9/USART1_TX/TIM1_CH2/_I2C3_SMBA/SPI2_SCK/FDCAN1_RXFD_MODE)
PA10: R177.2 R353.2 U16.102(PA10/USART1_RX/TIM1_CH3/FDCAN1_TXFD_MODE)
PA_State: R228.2 R309.2 U23.13(3C)
Port_D0: R115.2 ; port Port_D0
Port_D1: R123.2 ; port Port_D1
Port_D2: R142.1 ; port Port_D2
Port_D3: R141.1 ; port Port_D3
Port_D4: R119.1 ; port Port_D4
Port_D5: R113.1 ; port Port_D5
Port_D6: R111.1 ; port Port_D6
Port_D7: R100.1 ; port Port_D7
Port_D8: R98.1 ; port Port_D8
Port_D9: R95.1 ; port Port_D9
Port_D10: R94.1 ; port Port_D10
Port_D11: R59.1 ; port Port_D11
Port_D12: R47.1 ; port Port_D12
Port_D13: R27.1 ; port Port_D13
Port_D14: R26.1 ; port Port_D14
Port_D15: R20.1 ; port Port_D15
power11_led: D2.1 J5.A5 R19.1
power22_led: D7.1 J5.B5 R168.1
power_led_9: D43.1 J5.A2 R25.1
power_led_10: D44.1 J5.A6 R43.1
power_led_11: D45.1 J5.A1 R214.1
power_led_12: D47.1 J5.B2 R215.1
power_led_13: D20.1 J8.A5 R230.1
power_led_14: D21.1 J8.A9 R24.2
power_led_15: D22.1 J8.A4 R229.1
power_led_16: D56.1 J8.A8 R213.1
power_led_17: D57.1 J8.A2 R231.1
power_led_18: D58.1 J8.A1 R42.1
PPS: R200.2 R218.2 R312.2 U12.5(Vo) U23.3(1A)
PPS+: D46.2 J8.B7 R183.1 R184.2
PPS-: J8.B2 R185.2 R187.2
PTT_SW: R176.2 ; port PTT_SW
PWM_Ctrl: D19.2 D68.1 J9.3 R56.1
PWM_Ext_IN: D65.1 D70.2 J9.7 U43.3(Cathode)
PWM_Ext_IN_ISO: R302.1 R317.2 U43.5(Vo)
PWM_Int: D34.2 D69.1 J9.2 R90.1
RC2+_PSW: J6.B4 R224.1
RC2-_PSW: J6.B5 R313.1 R314.1
red_ctrl: R208.2 ; port red_ctrl
reset: C93.2 D27.1 J2.1 R153.1 U29.1(G)
RF_EN1: D54.1 J8.B5 R58.2 U42.5(Vo)
RF_EN2: D55.1 J9.5 R15.2 U41.5(Vo)
RS485-A_power: D17.1 J3.B5 R44.2 R186.2 U5.6(A)
RS485-B_power: D17.2 J3.B4 R33.1 R186.1 U5.7(B)
SPI1_MISO: R328.1 ; port SPI1_MISO
SPI1_MOSI: R329.1 ; port SPI1_MOSI
SPI1_NSS: R327.1 ; port SPI1_NSS
SPI1_SCK: R326.1 ; port SPI1_SCK
SPI2_MISO: R30.2 ; port SPI2_MISO
SPI2_MOSI: R29.2 ; port SPI2_MOSI
SPI2_NSS: R35.2 ; port SPI2_NSS
SPI2_SCK: R32.2 ; port SPI2_SCK
State_out1+: D48.2 J6.B1 R189.1 U13.6
State_out1-: FB21.1 J6.B6 U13.4
State_out2+: D50.2 J8.B1 R193.1 U15.6
State_out2-: FB23.1 J8.B6 U15.4
T_DE3: U5.2(~{RE}) U5.3(DE) U28.4(Y)
temp11_led: D3.1 J5.A9 R23.1
temp22_led: D8.1 J5.B9 R169.1
UART1_RX: J3.B1 R353.1
UART1_TX: J3.B6 R354.1
UART2_RX: R13.1 U16.37(PA3/USART2_RX/TIM2_CH4/TIM5_CH4/TIM15_CH2/ETH_MII_COL/ADC12___INP15)
UART2_TX: R14.1 U16.36(PA2/USART2_TX/TIM2_CH3/TIM5_CH3/TIM15_CH1/ETH_MDIO/ADC12___INP14)
UART3_RX: R211.1 U16.78(PD9/USART3_RX/FDCAN2_RXFD_MODE)
UART3_RX-2: R36.1 U36.7(VIA)
UART3_TX: R212.1 U16.77(PD8/USART3_TX)
UART3_TX-2: R41.1 R210.1 U36.6(VOB)
USERLOCK: R222.2 U23.9(2Y) U23.11(3A)
USERLOCK_EN: R16.1 R105.1 R190.1 R197.1 R323.2 R324.2 U16.119(PD5/USART2_TX/FDCAN1_TXFD_MODE) U23.10(3Y)
VENV2-: U16.22(PF10/TIM16_BKIN/ADC3___INN2/ADC3___INP6) ; port VENV2-
VENV+: U16.29(PC3_C/SPI2_MOSI/ETH_MII_TX_CLK/ADC3___INP1) ; port VENV+
VENV-: U16.27(PC1/SPI2_MOSI/ETH_MDC/ADC123___INN10/ADC123___INP11) ; port VENV-
VOLT_DEC: U16.43(PA7/SPI1_MOSI/TIM8_CH1N/TIM1_CH1N/TIM3_CH2/SPI6_MOSI/TIM14_CH1/ETH_MII_RX_DV/ADC12___INN3/ADC12___INP7) ; port VOLT_DEC
VRMS2-: U16.18(PF6/SPI5_NSS/UART7_Rx/TIM16_CH1/ADC3___INN4/ADC3___INP8) ; port VRMS2-
VRMS+: U16.28(PC2_C/SPI2_MISO/ETH_MII_TXD2/ADC3___INN1/ADC3___INP0) ; port VRMS+
VRMS-: U16.26(PC0/ADC123_INP10) ; port VRMS-
W5500_INTn: U16.60(PE9/TIM1_CH1/UART7_RTS) ; port W5500_INTn
W5500_INTn1: U16.70(PB11/I2C2_SDA/USART3_RX/TIM2_CH4/ETH_MII_TX_EN) ; port W5500_INTn1
W5500_RSTn: U16.59(PE8/TIM1_CH1N/UART7_Tx) ; port W5500_RSTn
W5500_RSTn1: U16.69(PB10/I2C2_SCL/USART3_TX/SPI2_SCK/ETH_MII_RX_ER/TIM2_CH3) ; port W5500_RSTn1
waterflow1: D15.2 FB35.1 J3.B7
waterflow_CPU1: C126.2 C127.2 R318.2 U16.35(PA1/UART4_RX/TIM2_CH2/TIM5_CH2/TIM15_CH1N/USART2_RTS/ETH_MII_RX_CLK/ADC1___INN16/ADC1___INP17)
watertemp1: D14.2 FB34.1 J3.B8
watertemp_CPU1: C85.2 C122.2 R151.2 U16.34(PA0/UART4_TX/TIM2_CH1/TIM5_CH1/TIM8_ETR/TIM15_BKIN/ETH_MII_CRS/ADC1___INP16/USART2_CTS)
NetBT1_1: BT1.1(+) D53.1 R216.1
NetC10_1: C10.1 FB5.1 U16.143(PDR_ON)
NetC12_1: C12.1 U3.4(C2+)
NetC12_2: C12.2 U3.5(C2-)
NetC15_1: C15.1 U3.6(Vs-)
NetC16_1: C16.1 U3.1(C1+)
NetC16_2: C16.2 U3.3(C1-)
NetC17_1: C17.1 U3.2(Vs+)
NetC23_2: C23.2 U16.106(VCAP)
NetC24_1: C24.1 U16.71(VCAP)
NetC84_2: C84.2 FB34.2 R149.1
NetC94_1: C94.1 FB20.1 J2.2
NetC111_2: C111.2 D52.1(K) D62.2(A) D63.1(K) R304.2
NetC123_2: C123.2 FB35.2 R306.1
NetC138_2: C138.2 C139.1 FB4.1 X3.4(VCC)
NetC1053_2: C1053.2 C1054.1 FB1007.2 U1007.8
NetC1061_2: C1061.2 R1026.1 U1007.3(+)
NetC1068_2: C1068.2 R1038.1 U1007.5(+)
NetD6_1: D6.1 FB8.1 J5.B1
NetD11_1: D11.1 FB18.1 J5.A3
NetD12_1: D12.1 FB19.1 J5.B3
NetD16_1: D16.1 FB36.1 J12.2
NetD41_1: D41.1 FB2.1 J8.A3
NetD52_2: D52.2(A) TR1.6
NetD63_2: D63.2(A) TR1.4
NetF1_1: F1.1 R52.2
NetF2_1: F2.1 R49.2
NetFB3_1: FB3.1 R182.1 U8.3(Cathode)
NetFB7_2: FB7.2 U11.3
NetFB10_1: FB10.1 U41.3(Cathode)
NetFB11_1: FB11.1 R187.1 U12.3(Cathode)
NetFB22_1: FB22.1 R199.1 U14.3(Cathode)
NetFB24_1: FB24.1 R207.1 U25.3(Cathode)
NetFB33_1: FB33.1 U42.3(Cathode)
NetJ6_A5: J6.A5 TP2.1(TP)
NetQ2_1: Q2.1(B) R39.2 R315.2
NetQ6_1: Q6.1(B) R40.2 R316.2
NetQ7_1: Q7.1(B) R340.2 R342.2
NetQ8_1: Q8.1(B) R341.2 R343.2
NetQ9_1: Q9.1(B) R225.2 R226.2
NetQ9_3: Q9.3(C) R104.2
NetQ12_1: Q12.1(B) R344.2 R346.2
NetQ13_1: Q13.1(B) R345.2 R347.2
NetQ14_1: Q14.1(B) R190.2 R348.2
NetQ14_3: Q14.3(C) U13.3
NetQ15_1: Q15.1(B) R197.2 R349.2
NetQ15_3: Q15.3(C) U15.3
NetR9_1: R9.1 R53.1 R55.2 R103.2 R314.2
NetR9_2: R9.2 U4.10
NetR10_2: R10.2 U16.138(BOOT0)
NetR11_1: R11.1 U16.137(PB7/I2C1_SDA/TIM17_CH1N/TIM4_CH2/I2C4_SDA/USART1_RX/FDCAN2_TXFD_MODE)
NetR12_1: R12.1 U16.136(PB6/I2C1_SCL/TIM16_CH1N/TIM4_CH1/I2C4_SCL/USART1_TX/UART5_TX/FDCAN2_TX)
NetR13_2: R13.2 U3.12(R1OUT)
NetR14_2: R14.2 U3.11(T1IN)
NetR16_2: R16.2 U41.1(Anode)
NetR19_2: R19.2 U16.44(PC4/ETH_RMII_RXD0/ADC12___INP4)
NetR20_2: R20.2 U16.132(PG15/USART6_CTS)
NetR21_2: R21.2 U16.48(PB2/SPI3_MOSI)
NetR22_2: R22.2 U11.1
NetR23_2: R23.2 U16.45(PC5/ETH_RMII_RXD1/ADC12___INN4/ADC12___INP8)
NetR24_1: R24.1 U16.98(PC8/TIM3_CH3/TIM8_CH3/USART6_CK/UART5_RTS)
NetR25_2: R25.2 U16.80(PD11/_I2C4_SMBA/USART3_CTS)
NetR26_2: R26.2 U16.129(PG14/SPI6_MOSI/USART6_TX/ETH_MII_TXD1)
NetR27_2: R27.2 U16.128(PG13/_SPI6_SCK/USART6_CTS/ETH_MII_TXD0)
NetR29_1: R29.1 U16.67(PE14/TIM1_CH4/SPI4_MOSI)
NetR30_1: R30.1 U16.66(PE13/TIM1_CH3/SPI4_MISO)
NetR31_2: R31.2 U39.1
NetR32_1: R32.1 U16.65(PE12/TIM1_CH3N/SPI4_SCK)
NetR35_1: R35.1 U16.64(PE11/TIM1_CH2/SPI4_NSS)
NetR36_2: R36.2 U5.1(RO)
NetR37_1: R37.1 U29.3(D)
NetR37_2: R37.2 U40.1
NetR41_2: R41.2 U5.4(DI)
NetR42_2: R42.2 U16.96(PC6/USART6_TX/TIM3_CH1/TIM8_CH1)
NetR43_2: R43.2 U16.81(PD12/TIM4_CH1/_I2C4_SCL/USART3_RTS)
NetR45_1: R45.1 X3.3(OUT)
NetR47_2: R47.2 U16.127(PG12/SPI6_MISO/USART6_RTS/ETH_MII_TXD1)
NetR49_1: R49.1 U3.14(T1OUT)
NetR50_1: R50.1 R57.1 U8.1(Anode)
NetR51_2: R51.2 U6.3(~{WP})
NetR52_1: R52.1 U3.13(R1IN)
NetR56_2: R56.2 U16.104(PA12/TIM1_ETR/SPI2_SCK/UART4_TX/_USART1_RTS/FDCAN1_TX)
NetR59_2: R59.2 U16.126(PG11/ETH_MII_TX_EN/SPI1_SCK)
NetR89_2: R89.2 U6.7(~{HOLD})
NetR90_2: R90.2 U16.85(PD14/TIM4_CH3/UART8_CTS)
NetR91_2: R91.2 U6.2(DO)
NetR92_1: R92.1 U6.6(CLK)
NetR93_1: R93.1 U6.5(DI)
NetR94_2: R94.2 U16.125(PG10/SPI1_NSS)
NetR95_2: R95.2 U16.124(PG9/USART6_RX/SPI1_MISO)
NetR96_2: R96.2 U16.40(PA4/SPI1_NSS/SPI3_NSS/TIM5_ETR/USART2_CK/SPI6_NSS/ADC12___INP18/DAC1___OUT1)
NetR97_2: R97.2 U16.41(PA5/SPI1_SCK/TIM2_CH1/TIM8_CH1N/SPI6_SCK/ADC12___INN18/_ADC12___INP19/DAC1___OUT2)
NetR98_2: R98.2 U16.93(PG8/TIM8_ETR/SPI6_NSS/USART6_RTS/_ETH_PPS_OUT)
NetR100_2: R100.2 U16.92(PG7/USART6_CK)
NetR103_1: R103.1 R144.1 R146.2 U4.1
NetR104_1: R104.1 U4.2
NetR105_2: R105.2 U42.1(Anode)
NetR106_1: R106.1 U16.10(PF0/I2C2_SDA)
NetR107_1: R107.1 U16.13(PF3/ADC3_INP5)
NetR111_2: R111.2 U16.91(PG6/TIM17_BKIN)
NetR113_2: R113.2 U16.90(PG5/TIM1_ETR)
NetR115_1: R115.1 U16.56(PG0)
NetR116_2: R116.2 U16.46(PB0/TIM1_CH2N/TIM8_CH2N/TIM3_CH3/UART4_CTS/ETH_MII_RXD2/ADC12___INN5/ADC12___INP9)
NetR119_2: R119.2 U16.89(PG4/TIM1_BKIN2/TIM1_BKIN2_COMP12)
NetR123_1: R123.1 U16.57(PG1)
NetR127_1: R127.1 U16.113(PC12/UART5_TX/USART3_CK/SPI3_MOSI)
NetR128_1: R128.1 U16.112(PC11/UART4_RX/USART3_RX/SPI3_MISO)
NetR129_1: R129.1 U16.111(PC10/UART4_TX/USART3_TX/SPI3_SCK)
NetR141_2: R141.2 U16.88(PG3/TIM8_BKIN2/TIM8_BKIN2_COMP12)
NetR142_2: R142.2 U16.87(PG2/TIM8_BKIN/TIM8_BKIN_COMP12)
NetR149_2: R149.2 R150.1 R154.2
NetR150_2: R150.2 U7.3(+)
NetR151_1: R151.1 R161.2 U7.1
NetR152_1: R152.1 U16.5(PE6/SPI4_MOSI/TIM1_BKIN2_COMP12/TIM15_CH2)
NetR158_2: R158.2 R161.1 U7.2(-)
NetR162_1: R162.1 U16.79(PD10/USART3_CK/FDCAN2_TXFD_MODE)
NetR165_2: R165.2 U16.68(PE15/TIM1_BKIN/TIM1_BKIN_COMP12)
NetR167_2: R167.2 U16.47(PB1/TIM1_CH3N/TIM8_CH3N/TIM3_CH4/ETH_MII_RXD3/ADC12___INP5)
NetR168_2: R168.2 U16.49(PF11/SPI5_MOSI/ADC1___INP2)
NetR169_2: R169.2 U16.50(PF12/ADC1___INN2/ADC1___INP6)
NetR170_2: R170.2 U16.53(PF13/_I2C4_SMBA/ADC2___INP2)
NetR171_2: R171.2 U16.54(PF14/I2C4_SCL/ADC2___INN2/ADC2___INP6)
NetR173_1: R173.1 U16.9(PC15/OSC32_OUT)
NetR174_1: R174.1 U16.14(PF4/ADC3___INN5/ADC3___INP9)
NetR175_1: R175.1 U16.15(PF5/ADC3___INP4)
NetR176_1: R176.1 U16.42(PA6/SPI1_MISO/TIM8_BKIN/TIM1_BKIN/TIM3_CH1/SPI6_MISO/TIM13_CH1/ADC12___INP3/TIM8_BKIN_COMP12/TIM1_BKIN_COMP12)
NetR184_1: R184.1 R185.1 U12.1(Anode)
NetR188_2: R188.2 U13.1
NetR192_2: R192.2 U15.1
NetR194_1: R194.1 R198.1 U14.1(Anode)
NetR203_2: R203.2 U23.5(1C)
NetR204_1: R204.1 R206.1 U25.1(Anode)
NetR205_1: R205.1 U23.8(2C)
NetR208_1: R208.1 U16.12(PF2/I2C2_SMBA)
NetR209_1: R209.1 U16.135(PB5/TIM17_BKIN/TIM3_CH2/I2C1_SMBA/SPI1_MOSI/I2C4_SMBA/SPI3_MOSI/SPI6_MOSI/ETH_PPS_OUT/UART5_RX/FDCAN2_RX)
NetR210_2: R210.2 U28.2(A)
NetR211_2: R211.2 U36.2(VOA)
NetR212_2: R212.2 U36.3(VIB)
NetR213_2: R213.2 U16.97(PC7/USART6_RX/TIM3_CH2/TIM8_CH2)
NetR214_2: R214.2 U16.63(PE10/TIM1_CH2N/UART7_CTS)
NetR215_2: R215.2 U16.58(PE7/TIM1_ETR/UART7_Rx)
NetR221_1: R221.1 U16.123(PD7/USART2_CK/SPI1_MOSI)
NetR222_1: R222.1 U16.122(PD6/USART2_RX/FDCAN2_RXFD_MODE/SPI3_MOSI)
NetR223_1: R223.1 U16.11(PF1/I2C2_SCL)
NetR224_2: R224.2 U4.5 U4.6
NetR229_2: R229.2 U16.103(PA11/TIM1_CH4/SPI2_NSS/UART4_RX/USART1_CTS/FDCAN1_RX)
NetR230_2: R230.2 U16.100(PA8/I2C3_SCL/TIM1_CH1/TIM8_BKIN2/USART1_CK/TIM8_BKIN2_COMP12/UART7_RX)
NetR231_2: R231.2 U16.99(PC9/I2C3_SDA/_TIM3_CH4/TIM8_CH4/UART5_CTS)
NetR302_2: R302.2 U16.82(PD13/TIM4_CH2/I2C4_SDA)
NetR303_2: R303.2 U38.1(EN)
NetR305_2: R305.2 U38.3(CLK)
NetR306_2: R306.2 R307.1 R319.2
NetR307_2: R307.2 U7.5(+)
NetR308_1: R308.1 R352.2 U43.1(Anode)
NetR309_1: R309.1 U16.118(PD4/USART2_RTS/FDCAN1_RXFD_MODE)
NetR310_1: R310.1 U16.117(PD3/SPI2_SCK/USART2_CTS)
NetR311_1: R311.1 U16.116(PD2/_TIM3_ETR/UART5_RX)
NetR312_1: R312.1 U16.115(PD1/UART4_TX/FDCAN1_TX)
NetR318_1: R318.1 R321.2 U7.7
NetR320_2: R320.2 R321.1 U7.6(-)
NetR322_2: R322.2 U16.55(PF15/_I2C4_SDA)
NetR326_2: R326.2 U16.74(PB13/TIM1_CH1N/SPI2_SCK/USART3_CTS/ETH_MII_TXD1/UART5_TX/FDCAN2_TX)
NetR327_2: R327.2 U16.73(PB12/TIM1_BKIN/I2C2_SMBA/SPI2_NSS/USART3_CK/ETH_MII_TXD0/UART5_RX/TIM1_BKIN_COMP12/FDCAN2_RX)
NetR328_2: R328.2 U16.75(PB14/TIM1_CH2N/TIM12_CH1/TIM8_CH2N/USART1_TX/USART3_RTS/UART4_RTS/SPI2_MISO)
NetR329_2: R329.2 U16.76(PB15/TIM1_CH3N/TIM12_CH2/TIM8_CH3N/USART1_RX/_UART4_CTS/SPI2_MOSI)
NetR330_2: R330.2 U39.3
NetR332_2: R332.2 U39.5
NetR334_2: R334.2 U40.5
NetR336_2: R336.2 U39.7
NetR338_2: R338.2 U40.7
NetR350_1: R350.1 R1033.2 U1007.1
NetR351_1: R351.1 R1040.2 U1007.7
NetR1032_2: R1032.2 R1033.1 U1007.2(-)
NetR1039_2: R1039.2 R1040.1 U1007.6(-)
NetTP9_1: TP9.1(TP) U16.139(PB8/TIM16_CH1/TIM4_CH3/I2C1_SCL/I2C4_SCL/UART4_RX/ETH_MII_TXD3/FDCAN1_RX)
NetTP10_1: TP10.1(TP) U16.140(PB9/TIM17_CH1/TIM4_CH4/I2C1_SDA/SPI2_NSS/_I2C4_SDA/I2C4_SMBA/UART4_TX/FDCAN1_TX)
NetTR1_1: TR1.1 U38.6(VD1)
NetTR1_3: TR1.3 U38.4(VD2)

Not connected (* = marked no-connect by the designer): C93 1; J3 B11; J8 B4; RJ3 9(K1) 10(A1) 11(K2) 12(A2) 15* 16*; U3 7(T2OUT) 9(R2OUT); U16 24(PH1-OSC_OUT); U19 2(NC)* 3(NC)* 5(NC)* 6(NC)* 7(NC)*; U28 1(NC); U40 3 4 13 14; X3 1(NC)*

## Notes on the sheet
- AVDD
- 水温度输入：1~5V
- 水流量输入：1~5V
- 参考电压接的独立3.3V
- 电平未知？
- 外部隔离PWM
- (near R57) 5V/24 快速联锁
- (near R217) 0
- 信号处理板隔离联锁
- (near R15) 0
- (near R218) 0
- 前级驱动联锁
- (near R58) 0
- (near R185) 24V PPS联锁
- (near J9) 开关信号处理班接口
- 外部联锁1
- 24V 状态输出1
- 机柜温度2
- 机柜温度1
- (near TP2) DIN
- 湿度传感器接口
- 电源插件指示灯
- (near J2) 整机面板指示灯
- (near R198) 24V MPS联锁1
- (near R219) 0
- 合成器温度1
- DOUT
- 调试LCD
- 用户外部联锁信号相当于一个开关
- ACDC电源的RS485总线口
- 入水出水温度及流量
- 外部联锁输入1
- (near J12) 激励插件驱动及功放检流
- IO复位，接复位按钮
- 24V 状态输出2
- 预留UART IO
- 外部联锁输出1
- 外部联锁输入2
- (near L3) 湿度传感器
- 电磁阀控制*2
- 外部联锁2
- (near R220) 0
- 三色报警灯*1
- (near R206) 24V MPS联锁2
- 激励插件温度
- Labels drawn without touching a wire or pin: GND, waterflow1, watertemp1

## Library data of the parts
BT1 = Battery: Multicell Battery; Published: 24-Mar-1999; LatestRevisionDate: 17-Jul-2002; LatestRevisionNote: Re-released for DXP Platform.; PackageReference: BAT-2; Publisher: Altium Limited; PackageDescription: Battery; 2 Leads
C1-C8 C10 C12 C13 C15-C18 C20 C21 C27 C81 C84 C85 C93 C103-C110 C115 C123-C126 C139-C141 C154 C155 C157-C160 C169 C1053 = 0.1uF贴片电容: 贴片电容_GRM188R71H104KA01D_0.1uF±10%,50V,0603; code: 01010045
C9 C11 C55 C138 C142 C171 = 10uF贴片电容: 贴片电容_GRM188R60J106ME47D_10uF±20%,6.3V,0603; code: 01010037
C14 C1054 = 1uF贴片电容: 贴片电容_GRM188R61A105KA61D_1uF±10%,10V,0603; code: 01010038
C19 = 10uF贴片电容: 贴片电容_GRM21BR61A106KE19L_10uF±10%,10V,0805; code: 01010036
C22 = 10uF贴片电容: 0603,2.2UF,50V,±10％,X5R
C23 C24 = 10uF贴片电容: 贴片电容_UMK107BBJ225KA-T_2.2uF±110%,50V,0603; MPN: Taiyo Yuden; code: 01010198
C80 = 10uF贴片电容: 贴片电容_GRM32ER71H106KA12L_10uF±10%,50V,1210; code: 03030021
C94 = 0.1uF: GRM188R71H104KA01D; MPN: MURATA; WSPN: 01010045
C111 = 4.7UF: 0603,4.7UF,16V,±10％,X5R; 名称: 贴片电容; 代码: 1.01.01.026; 规格型号: GRM188R61C475K; 品牌: Murata（村田）
C112 = 1UF: 0603,1UF,10V,±10％,X5R; 代码: 1.01.01.012; 名称: 贴片电容; 规格型号: GRM188R61A105KA61D; 品牌: Murata（村田）
C122 C127 = 0.1uF贴片电容: code: 01010045
C1061 C1068 = 100pF贴片电容: 贴片电容_GRM185C1H101K_100pF±10%,50V,0603; code: 01010095
D2 D20 D33 = ESD5B5.0ST1G
D3-D12 D16 D21 D22 D27-D32 D35-D41 D43-D45 D47 D56-D58 D68 D69 D71-D74 = ESD5B5.0ST1G: ESD_ESD3V3D3B_SOD-323,3.3V,双管
D13 = SM712: ESD_ESD15VAPB_SOT23
D14 D15 = ESD5B5.0ST1G: TVS_ESD5B5.0ST1G_SOD-523
D17 = SM712: ESD_ESDSM712_SOT23
D18 D42 D54 D55 D65 = ESD5B5.0ST1G: ESD_ESD5V0D3B_SOD-323,5V,双管
D19 D34 D46 D48-D51 D59 D66 D67 D70 = SMBJ12CA: TVS_SMBJ24CA_SMB封装
D52 D62 D63 = B0540WS: 二极管_SOD323
D53 = BAT54CW: TVS_BAT54CW_SOT323
F1 F2 = 自恢复保险丝_SMD020-1206
FB2 FB3 FB8 FB10 FB11 FB18 FB19 FB21-FB24 FB33 L1 L3 = 0805贴片磁珠: 贴片磁珠_600R,0805; code: 01030023
FB4 FB5 FB7 FB9 FB16 FB17 FB20 FB36 FB1007 = 0603贴片磁珠: 贴片磁珠_100R,0603; code: 0103016
FB34 FB35 = 0603贴片磁珠: code: 0103016
J1 = 8p-2.54单排母座: 连接器_单排排母座8p_直插,间距2.54mm; MPN: WS; code: 01090052
J2 J4 J9 J12 = DB9-90度弯针: 连接器_DB9母头_90度弯针; code: 0207003
J3 J5 J6 J8 = 双胞胎DB9DB9母头: 连接器_双胞胎DB9DB9母头_90度弯针，间距15.88mm; MPN: 亚当科技; code: 0207011
Q2 Q6-Q9 Q12-Q15 = MMBT2222: NPN三极管_MMBT2222_表贴SOT23; code: 01050001
R1-R7 R15 R17 R51 R58 R89 R120 R121 R153 R172 R217-R220 R228 R303 R317 R325 = 4.7K贴片电阻: 贴片电阻_4.7K±5%,0603; code: 01020012
R8 R10 R21 R225 = 1K贴片电阻: 贴片电阻_1K±5%,0603; code: 01020082
R9 R53 R55 R103 R144 R146 R158 R161 R224 R313 R314 R320 R321 R1026 R1038 = 0Ω贴片电阻: 贴片电阻_0Ω±5%,0603; code: 01020010
R11-R14 R36 R41 R49 R52 R57 R127-R129 R152 R176 R182 R185 R187 R198-R200 R202 R203 R205-R207 R209-R212 R221 R222 R309-R312 = 0Ω贴片电阻: code: 01020010
R16 R39 R40 R46 R105 R190 R315 R316 R340-R352 = 510Ω贴片电阻: 贴片电阻_510Ω±5%,0603; code: 01020103
R18 R33 R34 R38 R44 R331 R333 R335 R337 R339 = 1.5K贴片电阻: 贴片电阻_4.7K±5%,0603; code: 01020012
R19 R20 R23-R27 R29 R30 R32 R35 R42 R43 R45 R47 R56 R59 R90-R98 R100 R106 R107 R111 R113 R115 R116 R119 R123 R141 R142 R151 R167-R171 R173-R175 R177 R178 R208 R213-R215 R223 R229-R231 R302 R318 R322 R326-R329 R353 R354 = 30Ω贴片电阻: 贴片电阻_30Ω±5%,0603; code: 01020108
R22 R162 R165 = 300Ω贴片电阻: 贴片电阻_300Ω±5%,0603; code: 01020008
R31 R37 R188 R192 R323 R324 R330 R332 R334 R336 R338 = 33K贴片电阻: code: 01020011
R50 R183 R184 R189 R191 R193 R194 R201 R204 R227 R308 = 3K贴片电阻: 贴片电阻_3K±5%,1206; code: 01020048
R104 = 10Ω贴片电阻: 贴片电阻_10Ω±5%,0603; code: 01020104
R149 R306 = 1K贴片电阻
R150 R307 = 300Ω贴片电阻: 0603,100Ω,±5％; code: 01020008
R154 R197 R319 = 1K贴片电阻: code: 01020082
R186 = 120Ω贴片电阻: 贴片电阻_120Ω±5%,0603; code: 01020112
R216 = 1.5K贴片电阻: 贴片电阻_1.5K±5%,0603; code: 01020063
R226 = 6.2K贴片电阻: 贴片电阻_1K±5%,0603; code: 01020106
R304 = 4.7KΩ: 0603,4.7KΩ,±1％; 名称: 贴片电阻; 代码: 1.02.01.067; 规格型号: RC0603FR-074K7L; 品牌: YAGEO
R305 = 51KΩ: 0603,51KΩ,±1%; 名称: 贴片电阻
R1032 R1039 = 1K贴片电阻: 贴片电阻_1K±1%,0603; code: 01020082
R1033 R1040 = 4.7K贴片电阻: 贴片电阻_2K±1%,0603
RJ3 = RJ45弯脚带灯: RJ45插座_1*1,带左黄右绿灯,弯脚; MPN: 朱迅; code: 01090042
TP2 TP9 TP10 = TP0.8mm: 表贴测试点0.8mm
TR1 = VPT85BB-01A: 推挽变压器_表贴,隔离电压1500VDC
U1 = AT24C02N: EEPROM_AT24C02N_SOIC8; Maker: ATMEL; code: 01060068
U3 = MAX3232CSE: 双通道232收发器_MAX3232CSE_SOIC16; Maker: Maxim; code: 01060032
U4 = G5V-1-5VDC: 继电器_G5V-1-5VDC; MPN: OMRON; code: 01060120
U5 = SN65LBC184DR: 差分收发器_SN65LBC184DR_SOIC8; Maker: TI; code: 01060058
U6 = W25Q64CVSSIG: SPI存储芯片_W25Q64CVSSIG_SOIC8; MPN: WINBOND; code: 01060109
U7 = LM358
U8 U12 U14 U25 U41-U43 = TLP2368: 高速光耦合器_SO6封装,2.7~5.5V,3750Vrms
U11 U13 U15 = TLP181: 光耦_TLP181
U16 = STM32H743ZI: LQFP144,32-bit Arm, 480MHz MCUs, 2MB Flash,  1 MB RAM, analog interfaces, crypto
U19 = DS18B20U: 温度传感器_DS18B20U_uSOP8; code: 01060045
U23 = SN74HC4075DR: 3路或门_SN74HC4075_SOIC14; Maker: TI; code: 01060030
U28 = SN74AHC1G04DC: 单路非门_SN74AHC1G04DC_SC70-5; code: 010600100
U29 = Si2369DS-T1-GE3: P-MOS_Si2369DS-T1-GE3_SOT23; code: 01060087
U36 = ADuM1201A: 双通道数字隔离器_ADuM1201A_SOIC8; Maker: ADI
U38 = VPS8504: 推挽式变压器驱动器_SOT23-6,输入2.8~6V
U39 U40 = TLP291-4: 光耦_TLP181
U1007 = LM358: 运算放大器_LM358_SOIC8; Maker: MOTOROLA; code: 01060025
X3 = 16M贴片有源晶振: 贴片有源晶振_40M,20ppm,封装5x7; MPN: KDS; code: 03050020